# Altium schematic sheet ver_3.SchDoc
size A2; SheetNumber: 1; SheetTotal: 1
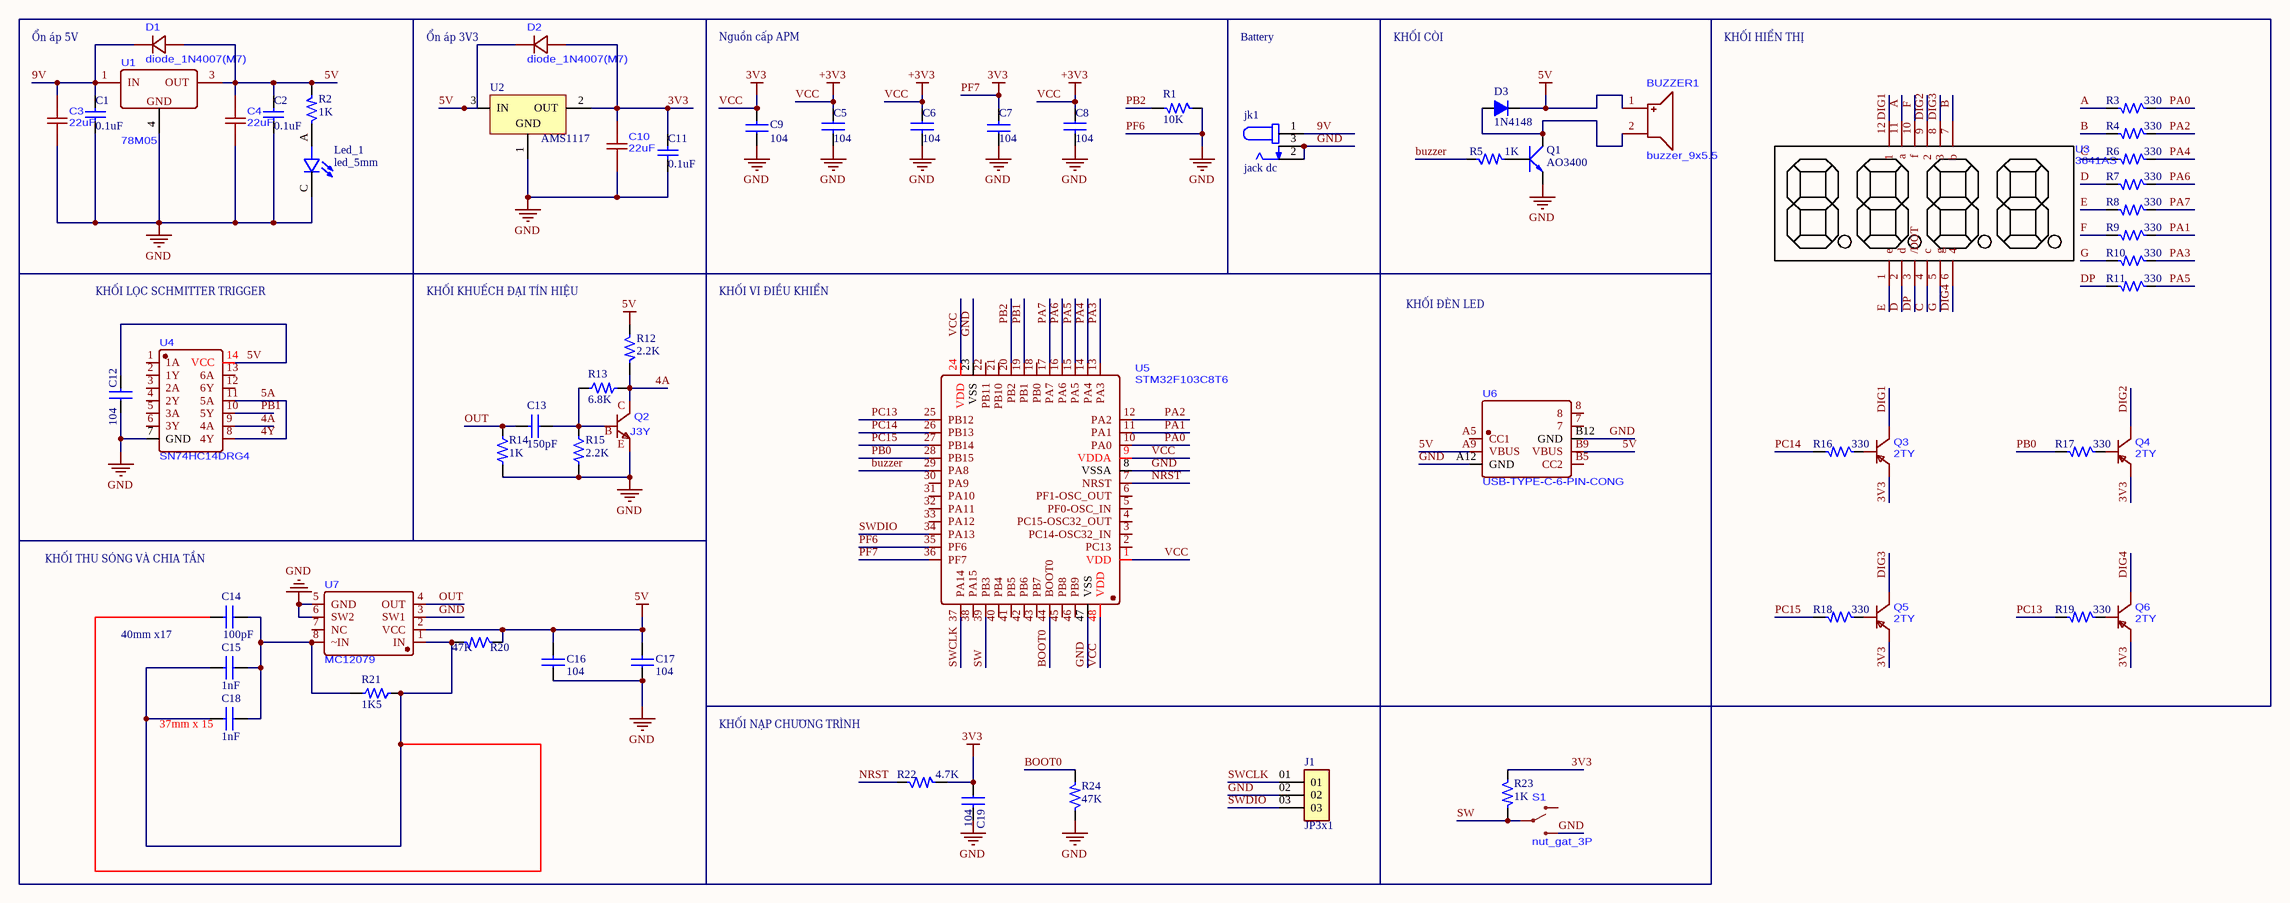
[diagram p0: ver_3.SchDoc]

## Parts
BUZZER1  buzzer_9x5.5  [buzzer_9x5.5]
C1  0.1uF  [CN-SMD-0603]
C2  0.1uF  [CN-SMD-0603]
C3  22uF  [cap_1206]
C4  22uF  [cap_1206]
C5  104  [CN-SMD-0603]
C6  104  [CN-SMD-0603]
C7  104  [CN-SMD-0603]
C8  104  [CN-SMD-0603]
C9  104  [CN-SMD-0603]
C10  22uF  [cap_1206]
C11  0.1uF  [CN-SMD-0603]
C12  104  [CN-SMD-0603]
C13  150pF  [CN-SMD-0603]
C14  100pF  [CN-SMD-0603]
C15  1nF  [CN-SMD-0603]
C16  104  [CN-SMD-0603]
C17  104  [CN-SMD-0603]
C18  1nF  [CN-SMD-0603]
C19  104  [CN-SMD-0603]
D1  diode_1N4007(M7)  [diode_1N4007-M7]
D2  diode_1N4007(M7)  [diode_1N4007-M7]
D3  1N4148  [SOD-123]
J1  JP3x1  [JP3x1]
jk1  jack dc  [jack dc]
Led_1  led_5mm  [led_5mm]
Q1  AO3400  [SOT23B]
Q2  J3Y  [j3y]
Q3  2TY  [2TY]
Q4  2TY  [2TY]
Q5  2TY  [2TY]
Q6  2TY  [2TY]
R1  10K  [RES-SMD-0603]
R2  1K  [RES-SMD-0603]
R3  330  [RES-SMD-0603]
R4  330  [RES-SMD-0603]
R5  1K  [RES-SMD-0603]
R6  330  [RES-SMD-0603]
R7  330  [RES-SMD-0603]
R8  330  [RES-SMD-0603]
R9  330  [RES-SMD-0603]
R10  330  [RES-SMD-0603]
R11  330  [RES-SMD-0603]
R12  2.2K  [RES-SMD-0603]
R13  6.8K  [RES-SMD-0603]
R14  1K  [RES-SMD-0603]
R15  2.2K  [RES-SMD-0603]
R16  330  [RES-SMD-0603]
R17  330  [RES-SMD-0603]
R18  330  [RES-SMD-0603]
R19  330  [RES-SMD-0603]
R20  47K  [RES-SMD-0603]
R21  1K5  [RES-SMD-0603]
R22  4.7K  [RES-SMD-0603]
R23  1K  [RES-SMD-0603]
R24  47K  [RES-SMD-0603]
S1  nut_gat_3P  [nut_gat_3p]
U1  78M05  [78M05]
U2  AMS1117  [AMS1117-SOT223]
U3  3641AS  [3641BS]
U4  SN74HC14DRG4  [74HC14]
U5  STM32F103C8T6  [LQFP-48_L7.0-W7.0-P0.50-LS9.0-BL]
U6  USB-TYPE-C-6-PIN-CONG  [USB-TYPE-C-6-PIN-CONG]
U7  MC12079  [MC12079]

## Nets
3V3: C5.1 C6.1 C7.2 C8.1 C9.2 C10.2 C11.2 C19.1 D2.2(A) Q3.2(E) Q4.2(E) Q5.2(E) Q6.2(E) R22.2 R23.1 U2.2(OUT) U5.1(VDD) U5.9(VDDA) U5.24(VDD) U5.36(PF7) U5.48(VDD)  [also labelled +3V3, PF7, VCC]
5V: BUZZER1.1 C2.2 C4.2 C12.2 C16.2 C17.2 D1.2(A) D2.1(K) D3.2(K) R2.2 R12.1 R20.1 U1.3(OUT) U2.3(IN) U4.14(VCC) U6.A9(VBUS) U6.B9(VBUS) U7.2(VCC)
GND: C1.1 C2.1 C3.1 C4.1 C5.2 C6.2 C7.1 C8.2 C9.1 C10.1 C11.1 C12.1 C16.1 C17.1 C19.2 J1.02 jk1.2 jk1.3 Led_1.C Q1.1(E) Q2.2(E) R1.1 R14.2 R15.2 R24.1 S1.3(S) U1.4(GND) U2.1(GND) U4.7(GND) U5.8(VSSA) U5.23(VSS) U5.35(PF6) U5.47(VSS) U6.A12(GND) U6.B12(GND) U7.3(SW1) U7.5(GND) U7.6(SW2)  [also labelled PF6]
4A: Q2.3(C) R12.2 R13.2 U4.9(4A)
4Y: U4.8(4Y) U4.11(5A)  [also labelled 5A]
9V: C1.2 C3.2 D1.1(K) jk1.1 U1.1(IN)
A: R3.2 U3.11(a)
B: R4.2 U3.7(b)
BOOT0: R24.2 U5.44(BOOT0)
buzzer: R5.1 U5.29(PA8)
C: R6.2 U3.4(c)
D: R7.2 U3.2(d)
DIG1: Q3.3(C) U3.12(1)
DIG2: Q4.3(C) U3.9(2)
DIG3: Q5.3(C) U3.8(3)
DIG4: Q6.3(C) U3.6(4)
DP: R11.2 U3.3(/DOT)
E: R8.2 U3.1(e)
F: R9.2 U3.10(f)
G: R10.2 U3.5(g)
NRST: R22.1 U5.7(NRST)
OUT: C13.2 R14.1 U7.4(OUT)
PA0: R3.1 U5.10(PA0)
PA1: R9.1 U5.11(PA1)
PA2: R4.1 U5.12(PA2)
PA3: R10.1 U5.13(PA3)
PA4: R6.1 U5.14(PA4)
PA5: R11.1 U5.15(PA5)
PA6: R7.1 U5.16(PA6)
PA7: R8.1 U5.17(PA7)
PB0: R17.2 U5.28(PB15)
PB1: U4.10(5Y) U5.19(PB1)
PB2: R1.2 U5.20(PB2)
PC13: R19.2 U5.25(PB12)
PC14: R16.2 U5.26(PB13)
PC15: R18.2 U5.27(PB14)
SW: R23.2 S1.2(P) U5.39(PB3)
SWCLK: J1.01 U5.37(PA14)
SWDIO: J1.03 U5.34(PA13)
NetBUZZER1_2: BUZZER1.2 D3.1(A) Q1.2(C)
NetC13_1: C13.1 Q2.1(B) R13.1 R15.1
NetC14_1: C14.1 C15.1 C18.1 R21.2 U7.8(~IN)
NetC14_2: C14.2 C15.2 C18.2 R20.2 R21.1 U7.1(IN)
NetLed_1_A: Led_1.A R2.1
NetQ1_3: Q1.3(B) R5.2
NetQ3_1: Q3.1(B) R16.1
NetQ4_1: Q4.1(B) R17.1
NetQ5_1: Q5.1(B) R18.1
NetQ6_1: Q6.1(B) R19.1

Not connected (* = marked no-connect by the designer): S1 1(O); U4 1(1A) 2(1Y) 3(2A) 4(2Y) 5(3A) 6(3Y) 12(6Y) 13(6A); U5 2(PC13) 3(PC14-OSC32_IN) 4(PC15-OSC32_OUT) 5(PF0-OSC_IN) 6(PF1-OSC_OUT) 18(PB0) 21(PB10) 22(PB11) 30(PA9) 31(PA10) 32(PA11) 33(PA12) 38(PA15) 40(PB4) 41(PB5) 42(PB6) 43(PB7) 45(PB8) 46(PB9); U6 7 8 A5(CC1) B5(CC2); U7 7(NC)

## Notes on the sheet
- Ổn áp 5V
- Ổn áp 3V3
- Nguồn cấp APM
- Battery
- KHỐI CÒI
- KHỐI HIỂN THỊ
- KHỐI LỌC SCHMITTER TRIGGER
- KHỐI KHUẾCH ĐẠI TÍN HIỆU
- KHỐI VI ĐIỀU KHIỂN
- KHỐI ĐÈN LED
- (near Q2) C
- (near Q2) B
- (near Q2) E
- KHỐI THU SÓNG VÀ CHIA TẦN
- 40mm x17
- (near C18) 37mm x 15
- KHỐI NẠP CHƯƠNG TRÌNH

## Library data of the parts
C1 C2 C11 = CAP 104
C3 C4 C10 = cap_1206
C5-C9 C12-C19 = Tu 0805_1: Tu 0805; Right: 20; Bottom: 10
D3 = D1A: Diode 1A; Value: 1N4007
Q1 = C1815: NPN 600mW, ECB; Value: C1815
Q2 = S8050/J3Y/0.4
R1 R12-R15 R20-R24 = Tro 0805_1: Tro 0805; Value: R1/4W - 1K
R2-R11 R16-R19 = Res: Resistor 1/4W; Value: R1/4W - 1K
U5 = APM32F030C8T6